# EAGLE design usb_to_serial_long (EAGLE 5.11)
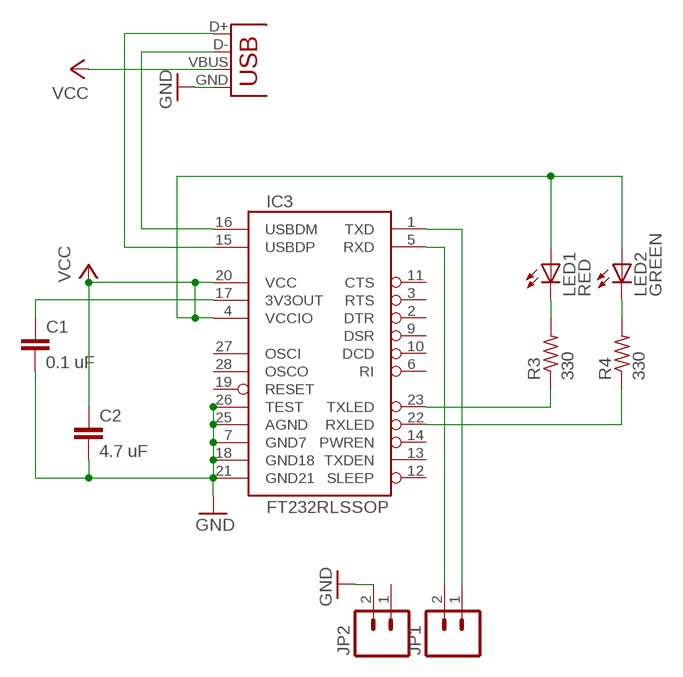
[diagram p0: schematic, sheet 1]

## Parts
C1  0.1 uF  C2,5-3  [C2.5-3]
C2  4.7 uF  C2,5-3  [C2.5-3]
IC3  FT232RLSSOP  [SSOP28DB]
JP1  M02PTH  [1X02]
JP2  M02PTH  [1X02]
LED1  RED  LED3MM  [LED3MM]
LED2  GREEN  LED3MM  [LED3MM]
R3  330  R-US_0207/10  [0207/10]
R4  330  R-US_0207/10  [0207/10]
X1  USBPTH  [USB-B-PTH]

## Nets
GND: C1.2 C2.2 IC3.7(GND7) IC3.18(GND18) IC3.21(GND21) IC3.25(AGND) IC3.26(TEST) JP2.2 X1.GND
N$1: IC3.1(TXD) JP1.1
N$2: IC3.5(RXD) JP1.2
N$13: IC3.15(USBDP) X1.D+
N$14: IC3.16(USBDM) X1.D-
N$15: IC3.23(TXLED) R3.1
N$16: C1.1 IC3.17(3V3OUT)
N$17: IC3.22(RXLED) R4.1
N$18: LED1.K(C) R3.2
N$19: LED2.K(C) R4.2
VCC: C2.1 IC3.4(VCCIO) IC3.20(VCC) LED1.A LED2.A X1.VBUS
Unconnected: IC3.2(DTR) IC3.3(RTS) IC3.6(RI) IC3.9(DSR) IC3.10(DCD) IC3.11(CTS) IC3.12(SLEEP) IC3.13(TXDEN) IC3.14(PWREN) IC3.19(RESET) IC3.27(OSCI) IC3.28(OSCO) JP2.1

## Library data of the parts
C1 C2 = capacitor-wima:C: CAPACITOR naming: grid - package width
IC3 = SparkFun:FT232RL: USB UART FT232RL 4th Generation USB UART (USB <-> Serial) Controller. Spark Fun Electronics SKU : COM-00650
JP1 JP2 = SparkFun:M02: Header 2 Standard 2-pin 0.1" header. Use with straight break away headers (SKU : PRT-00116), right angle break away headers (PRT-00553), swiss pins (PRT-00743), machine pins (PRT-00117), and female headers (PRT-00115). Molex polarized connector foot print use with SKU : PRT-08233 with associated crimp pins and housings.
LED1 LED2 = led:LED: LED OSRAM: - CHIPLED LG R971, LG N971, LY N971, LG Q971, LY Q971, LO R971, LY R971 LH N974, LH R974 LS Q976, LO Q976, LY Q976 LO Q996 - Hyper CHIPLED LW Q18S LB Q993, LB Q99A, LB R99A - SideLED LS A670, LO A670, LY A670, LG A670, LP A670 LB A673, LV A673, LT A673, LW A673 LH A674 LY A675 LS A676, LA A676, LO A676, LY A676, LW A676 LS A679, LY A679, LG A679 - Hyper Micro SIDELED® LS Y876, LA Y876, LO Y876, LY Y876 LT Y87S - SmartLED LW L88C, LW L88S LB L89C, LB L89S, LG L890 LS L89K, LO L89K, LY L89K LS L896, LA L896, LO L896, LY L896 - TOPLED LS T670, LO T670, LY T670, LG T670, LP T670 LSG T670, LSP T670, LSY T670, LOP T670, LYG T670 LG T671, LOG T671, LSG T671 LB T673, LV T673, LT T673, LW T673 LH T674 LS T676, LA T676, LO T676, LY T676, LB T676, LH T676, LSB T676, LW T676 LB T67C, LV T67C, LT T67C, LS T67K, LO T67K, LY T67K, LW E67C LS E67B, LA E67B, LO E67B, LY E67B, LB E67C, LV E67C, LT E67C LW T67C LS T679, LY T679, LG T679 LS T770, LO T770, LY T770, LG T770, LP T770 LB T773, LV T773, LT T773, LW T773 LH T774 LS E675, LA E675, LY E675, LS T675 LS T776, LA T776, LO T776, LY T776, LB T776 LHGB T686 LT T68C, LB T68C - Hyper Mini TOPLED® LB M676 - Mini TOPLED Santana® LG M470 LS M47K, LO M47K, LY M47K Source: http://www.osram.convergy.de LUXEON: - LUMILED® LXK2-PW12-R00, LXK2-PW12-S00, LXK2-PW14-U00, LXK2-PW14-V00 LXK2-PM12-R00, LXK2-PM12-S00, LXK2-PM14-U00 LXK2-PE12-Q00, LXK2-PE12-R00, LXK2-PE12-S00, LXK2-PE14-T00, LXK2-PE14-U00 LXK2-PB12-K00, LXK2-PB12-L00, LXK2-PB12-M00, LXK2-PB14-N00, LXK2-PB14-P00, LXK2-PB14-Q00 LXK2-PR12-L00, LXK2-PR12-M00, LXK2-PR14-Q00, LXK2-PR14-R00 LXK2-PD12-Q00, LXK2-PD12-R00, LXK2-PD12-S00 LXK2-PH12-R00, LXK2-PH12-S00 LXK2-PL12-P00, LXK2-PL12-Q00, LXK2-PL12-R00 Source: www.luxeon.com KINGBRIGHT: KA-3528ASYC Source: www.kingbright.com
R3 R4 = resistor:R-US_: RESISTOR, American symbol
X1 = SparkFun:USB: USB Connectors USB-B-PTH is fully proven SKU : PRT-00139 USB-miniB is fully proven SKU : PRT-00587 USB-A-PCB is untested. USB-A-H is throughly reviewed, but untested. Spark Fun Electronics SKU : PRT-00437 USB-B-SMT is throughly reviewed, but untested. Needs silkscreen touching up. USB-A-S has not been used/tested USB-MB-H has not been used/tested

## Board
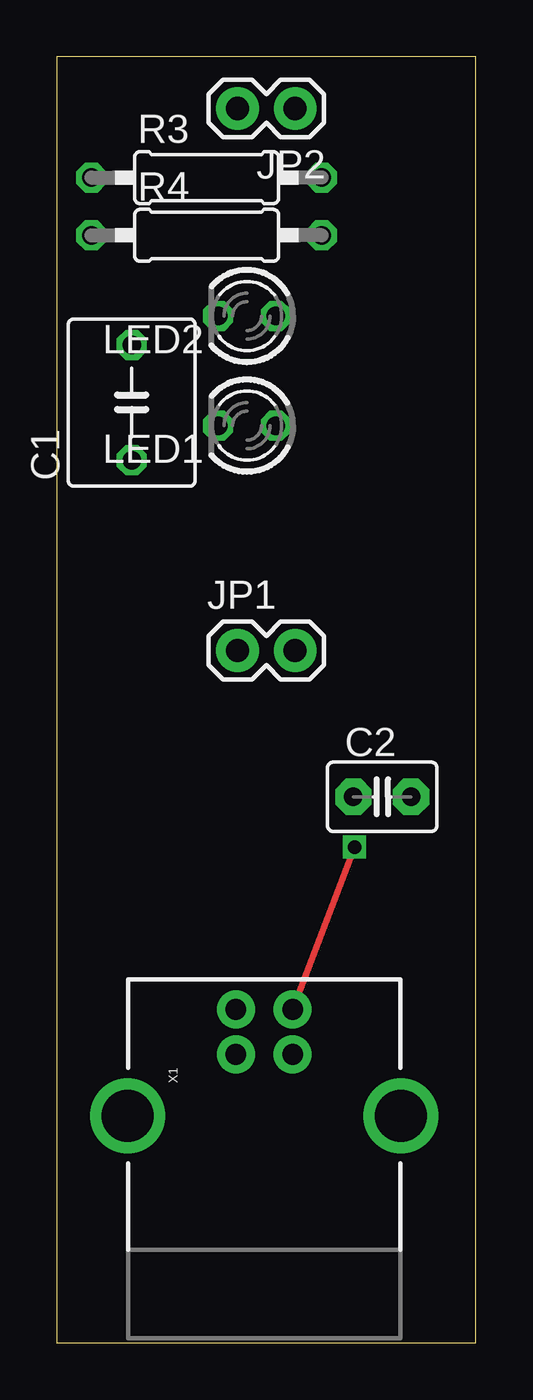
[diagram p1: board, top side]
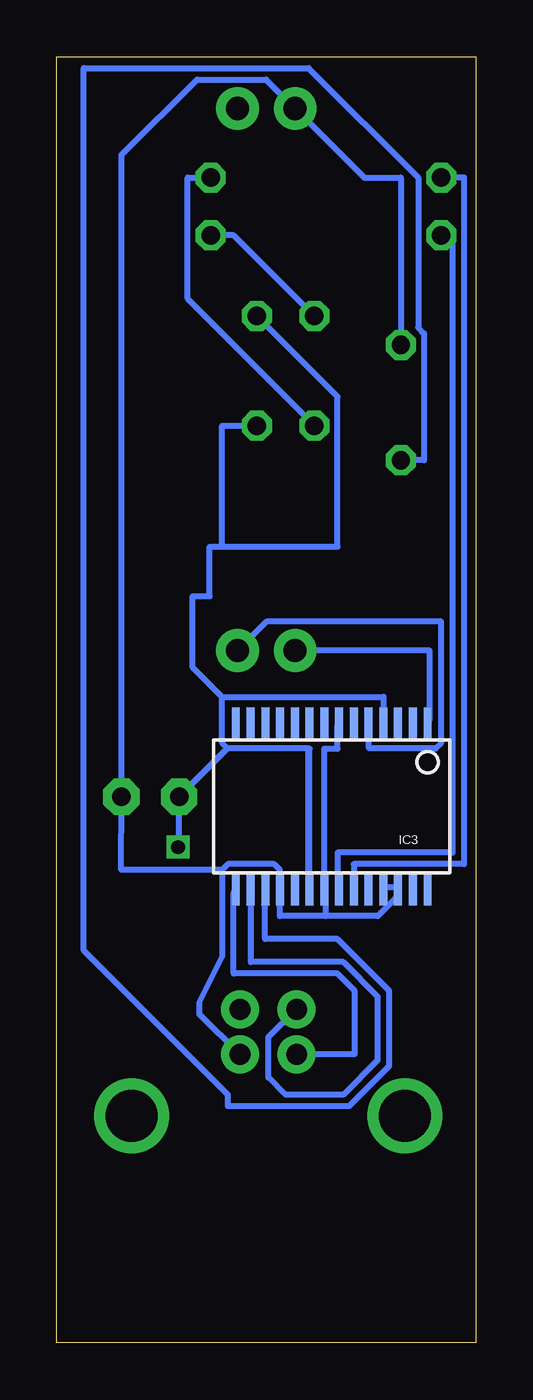
[diagram p2: board, bottom side, seen from below]

Size 18.47 x 56.63 mm. Coordinates in mm from the lower left corner, seen from the top.
Outline: 0,0 18.47,0 18.47,56.63 0,56.63 0,0
Copper layers (1*16): Top 0.035mm / dielectric 1.5mm / Bottom 0.035mm
Design rules "default": minimum track width 10mil, minimum drill 24mil, track to track 8mil, track to pad 8mil, pad to pad 8mil, via to via 8mil, smd to smd 8mil, copper to edge 40mil, drill to drill 8mil, minimum pad ring 10mil, minimum via ring 8mil, stop-mask expansion 4mil, vias tented up to drill 0mil, thermal gap 10mil

### Footprints (pad centres in the part's own frame; a part is rotated, then mirrored left to right if it is on the bottom)
C050-055X075 = drill 0.813 octagon: 1 -2.54,0; 2 2.54,0
C2.5-3 = drill 0.813 pad 1.6 octagon: 1 -1.27,0; 2 1.27,0
SSOP28DB = smd 0.348 x 1.397: 1 -4.225,-3.656; 2 -3.575,-3.656; 3 -2.925,-3.656; 4 -2.275,-3.656; 5 -1.625,-3.656; 6 -0.975,-3.656; 7 -0.325,-3.656; 8 0.325,-3.656; 9 0.975,-3.656; 10 1.625,-3.656; 11 2.275,-3.656; 12 2.925,-3.656; 13 3.575,-3.656; 14 4.225,-3.656; 15 4.225,3.656; 16 3.575,3.656; 17 2.925,3.656; 18 2.275,3.656; 19 1.625,3.656; 20 0.975,3.656; 21 0.325,3.656; 22 -0.325,3.656; 23 -0.975,3.656; 24 -1.625,3.656; 25 -2.275,3.656; 26 -2.925,3.656; 27 -3.575,3.656; 28 -4.225,3.656
1X02 = drill 1.016 pad 1.88 round: 1 0,0; 2 2.54,0
LED3MM = drill 0.813 octagon: A -1.27,0; K 1.27,0
0207/10 = drill 0.813 octagon: 1 -5.08,0; 2 5.08,0
USB-B-PTH = drill 0.914 pad 1.676 round: D+ 0,1.25; D- 1.981,1.25; GND 0,-1.25; VBUS 1.981,-1.25 | drill 2.286 round: P$1 -2.718,-6.02; P$2 -2.718,6.02

### Placement (x,y rotation side)
C1  0.1 uF  [C050-055X075]  3.3,41.4 90 top
C2  14.34,24.04 0 top
IC3  6.35,23.62 180 bottom
JP1  7.96,30.48 0 top
JP2  10.5,54.36 180 top
LED1  8.38,40.39 180 top
LED2  8.38,45.21 180 top
R3  6.6,51.31 0 top
R4  6.6,48.77 0 top
X1  9.14,12.7 90 top

### Tracks (layer width: path | path; a pad name or v marks a point on that pad's centre or on a via)
GND
  Bottom 0.254: C1.2 3.3,51.31 4.9,51.3 JP2.2 9.24,55.63 12.28,55.63 15.61,52.32 C2.2 15.63,20.83 11.18,20.83 | IC3.26 3.56,20.07 4.06,20.07 IC3.25 | IC3.7 6.1,27.18 6.1,26.16 6.67,26.16 IC3.21 6.6,20.07 6.6,18.8 | IC3.26 3.43,20.07 | 6.6,18.8 4.32,18.8 3.41,19.69 IC3.26 | 6.6,18.8 8.64,18.8 8.64,19.81 IC3.18 8.64,20.07 8.64,20.83 8.89,21.08 10.92,21.08 11.18,20.83 | 11.18,20.83 11.18,17.02 12.19,14.99 12.19,14.48 X1.GND
N$1
  Bottom 0.254: JP1.1 2.03,30.48 2.03,27.43 IC3.1
N$2
  Bottom 0.254: JP1.2 9.23,31.75 1.52,31.75 1.52,26.42 1.78,26.16 4.71,26.17 4.71,27.19 IC3.5
N$13
  Bottom 0.254: IC3.15 10.67,19.81 10.67,16.26 6.1,16.26 5.33,15.49 5.33,12.7 X1.D+
N$14
  Bottom 0.254: IC3.16 9.91,19.81 9.91,16.76 5.84,16.76 4.32,15.24 4.32,12.45 5.84,10.92 8.38,10.92 9.14,11.68 9.14,13.46 X1.D-
N$15
  Bottom 0.254: R3.1 0.51,51.31 0.51,21.08 5.38,21.08 IC3.23
N$16
  Bottom 0.254: C1.1 2.29,38.86 2.29,44.45 2.54,44.7 2.54,51.31 7.37,56.13 17.27,56.13 17.27,17.27 10.92,10.92 10.92,10.41 5.59,10.41 3.81,12.19 3.81,15.49 6.1,17.78 9.28,17.78 9.28,19.61 IC3.17
N$17
  Bottom 0.254: IC3.22 6.1,19.97 6.1,21.59 1.02,21.59 1.02,48.77 R4.1
N$18
  Bottom 0.254: LED1.K 12.7,45.97 12.7,51.31 R3.2
N$19
  Bottom 0.254: LED2.K 10.67,48.77 R4.2
VCC  (via drill 0.6)
  Top 0.254: v13.12,21.83 X1.VBUS
  Bottom 0.254: LED1.A 11.18,40.39 11.18,35.05 | LED2.A 6.1,41.66 6.1,35.05 11.18,35.05 | 11.18,35.05 11.73,35.05 11.73,32.88 12.47,32.88 12.47,29.74 11.18,28.45 | IC3.4 4.06,27.43 4.06,28.45 11.18,28.45 | 11.18,28.45 11.18,26.42 10.92,26.16 | 10.92,26.16 7.37,26.16 7.37,20.07 IC3.20 7.33,26.16 10.99,26.16 10.99,26.13 13.09,24.03 13.09,21.86 v13.12,21.83 | 10.92,26.16 10.95,26.16 C2.1